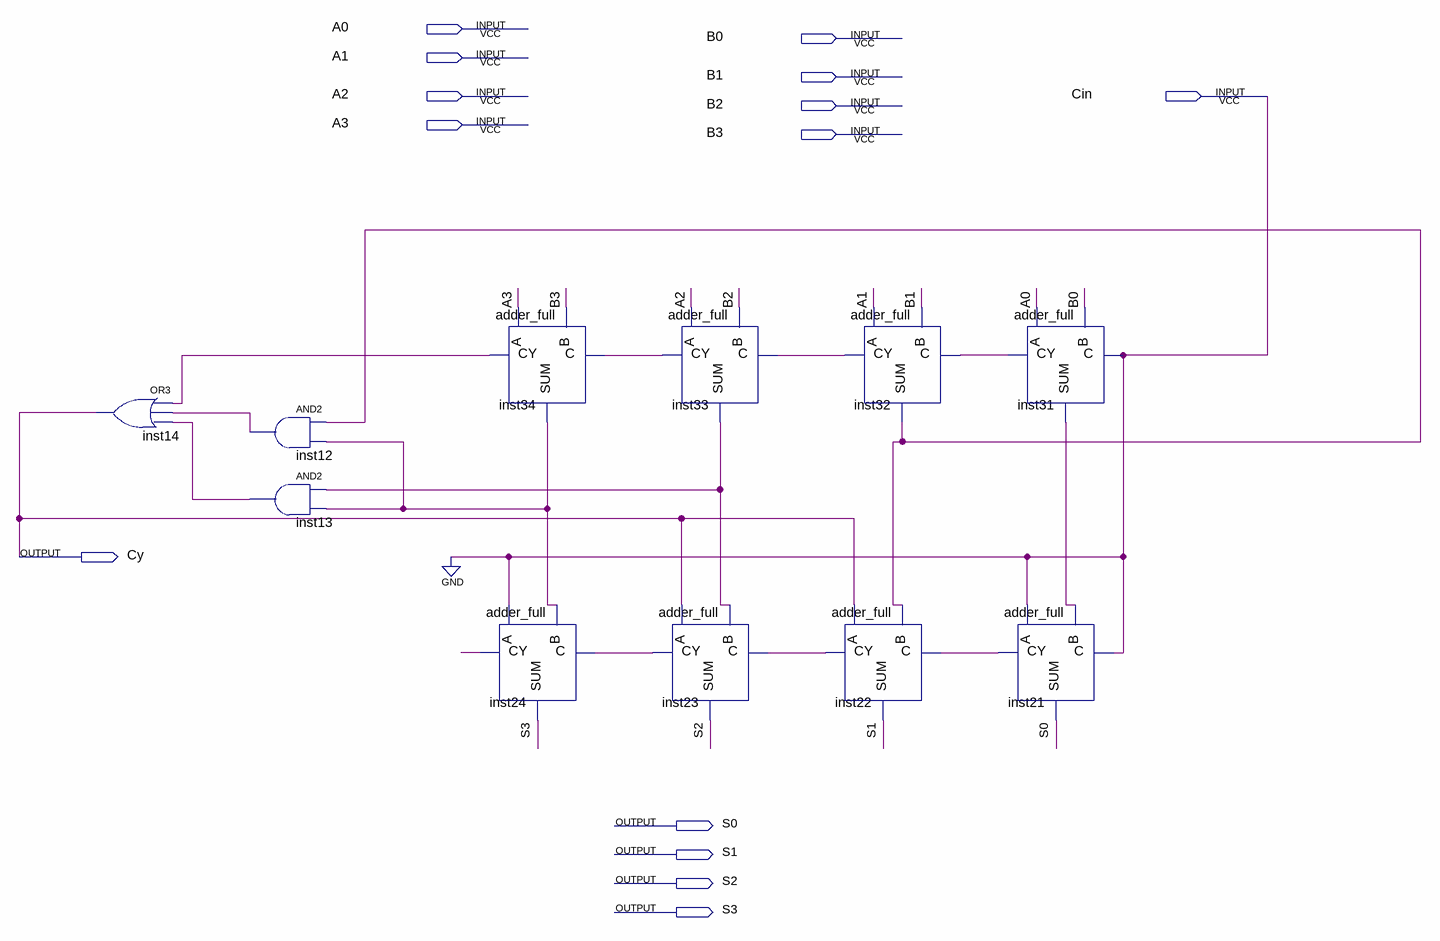
[diagram p0: schematic sheet]
// Quartus schematic bcd_adder.bdf as structural Verilog: 11 symbols, 14 pins
module bcd_adder (
  input  A0,
  input  B0,
  input  A1,
  input  B1,
  input  A2,
  input  Cin,
  input  B2,
  input  A3,
  input  B3,
  output Cy,
  output S0,
  output S1,
  output S2,
  output S3
);

  wire inst12_out, inst13_out, inst21_cy, inst22_cy, inst23_cy, inst24_cy, inst31_cy, inst31_sum, inst32_cy,
       inst32_sum, inst33_cy, inst33_sum, inst34_cy, inst34_sum;

  or inst14 (Cy, inst34_cy, inst12_out, inst13_out);
  and inst12 (inst12_out, inst32_sum, inst34_sum);
  and inst13 (inst13_out, inst33_sum, inst34_sum);
  adder_full inst34 (.A(A3), .B(B3), .C(inst33_cy), .CY(inst34_cy), .SUM(inst34_sum));
  adder_full inst24 (.A(Cin), .B(inst34_sum), .C(inst23_cy), .CY(inst24_cy), .SUM(S3));
  adder_full inst33 (.A(A2), .B(B2), .C(inst32_cy), .CY(inst33_cy), .SUM(inst33_sum));
  adder_full inst23 (.A(Cy), .B(inst33_sum), .C(inst22_cy), .CY(inst23_cy), .SUM(S2));
  adder_full inst32 (.A(A1), .B(B1), .C(inst31_cy), .CY(inst32_cy), .SUM(inst32_sum));
  adder_full inst22 (.A(Cy), .B(inst32_sum), .C(inst21_cy), .CY(inst22_cy), .SUM(S1));
  adder_full inst31 (.A(A0), .B(B0), .C(Cin), .CY(inst31_cy), .SUM(inst31_sum));
  adder_full inst21 (.A(Cin), .B(inst31_sum), .C(Cin), .CY(inst21_cy), .SUM(S0));
  // also tied to GND on the sheet: Cin
endmodule
